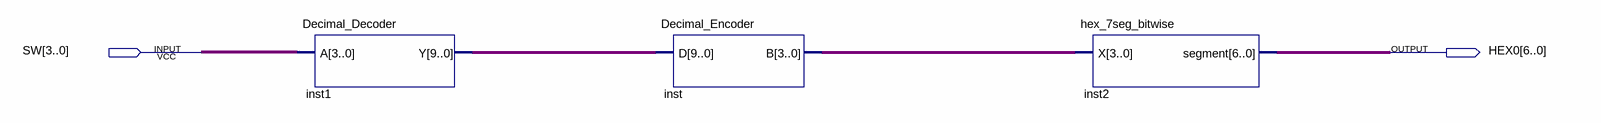
[diagram p0: schematic sheet]
// Quartus schematic Top_Level_Lab_3.bdf as structural Verilog: 3 symbols, 2 pins
module Top_Level_Lab_3 (
  input  [3:0] SW,
  output [6:0] HEX0
);

  wire [3:0] inst_b;
  wire [9:0] inst1_y;

  Decimal_Decoder inst1 (.A(SW), .Y(inst1_y));
  Decimal_Encoder inst (.D(inst1_y), .B(inst_b));
  hex_7seg_bitwise inst2 (.X(inst_b), .segment(HEX0));
endmodule
